# EasyEDA Pro project PCB_Claysight_MK2.epro

# Board PCB_Claysight-MK2
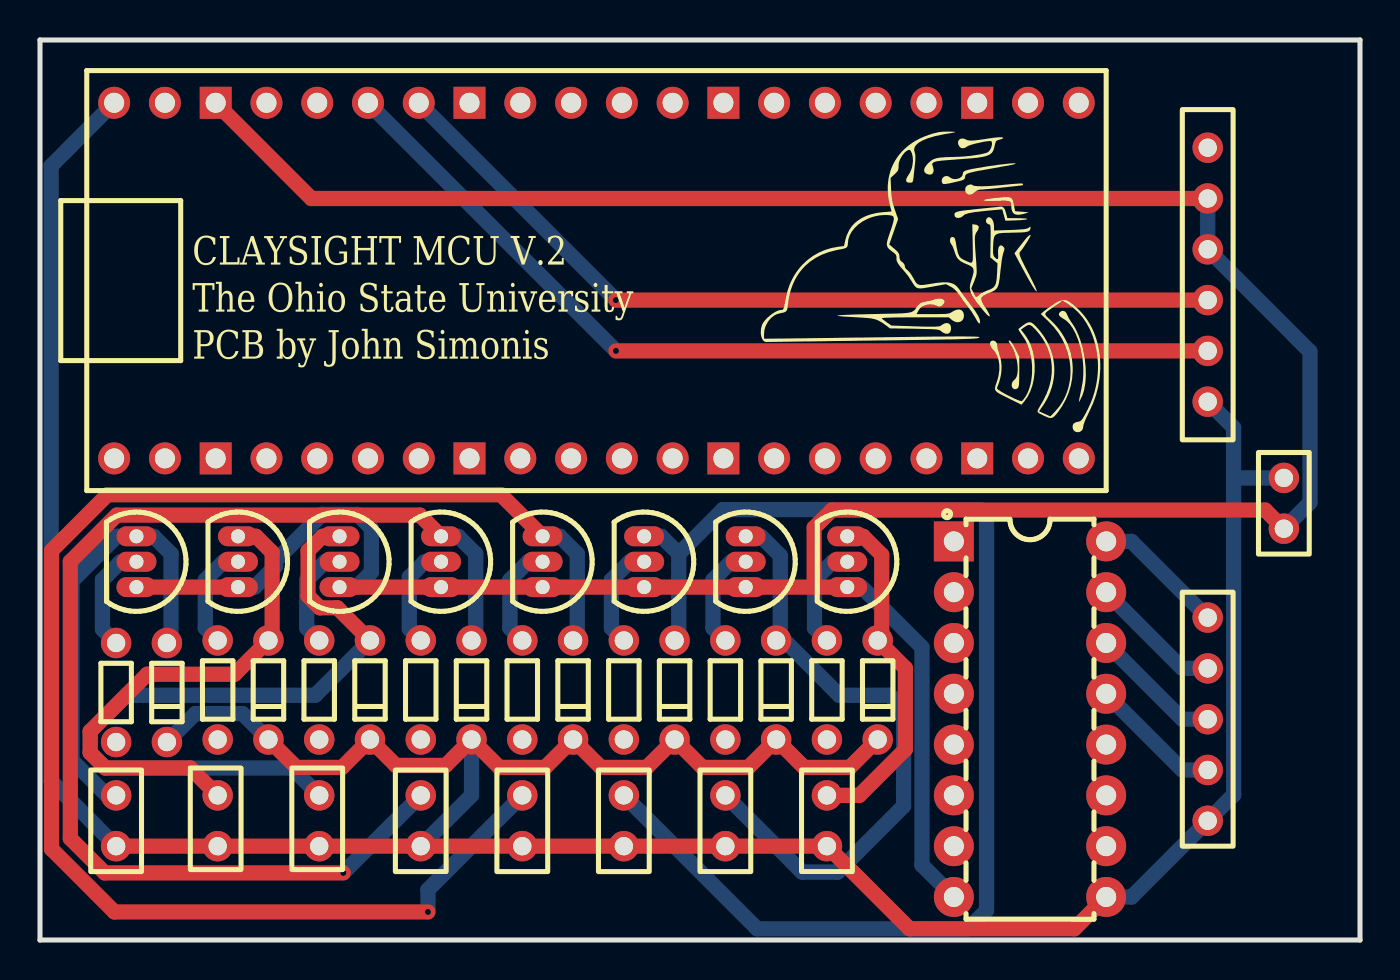
[diagram p0: board, top side]
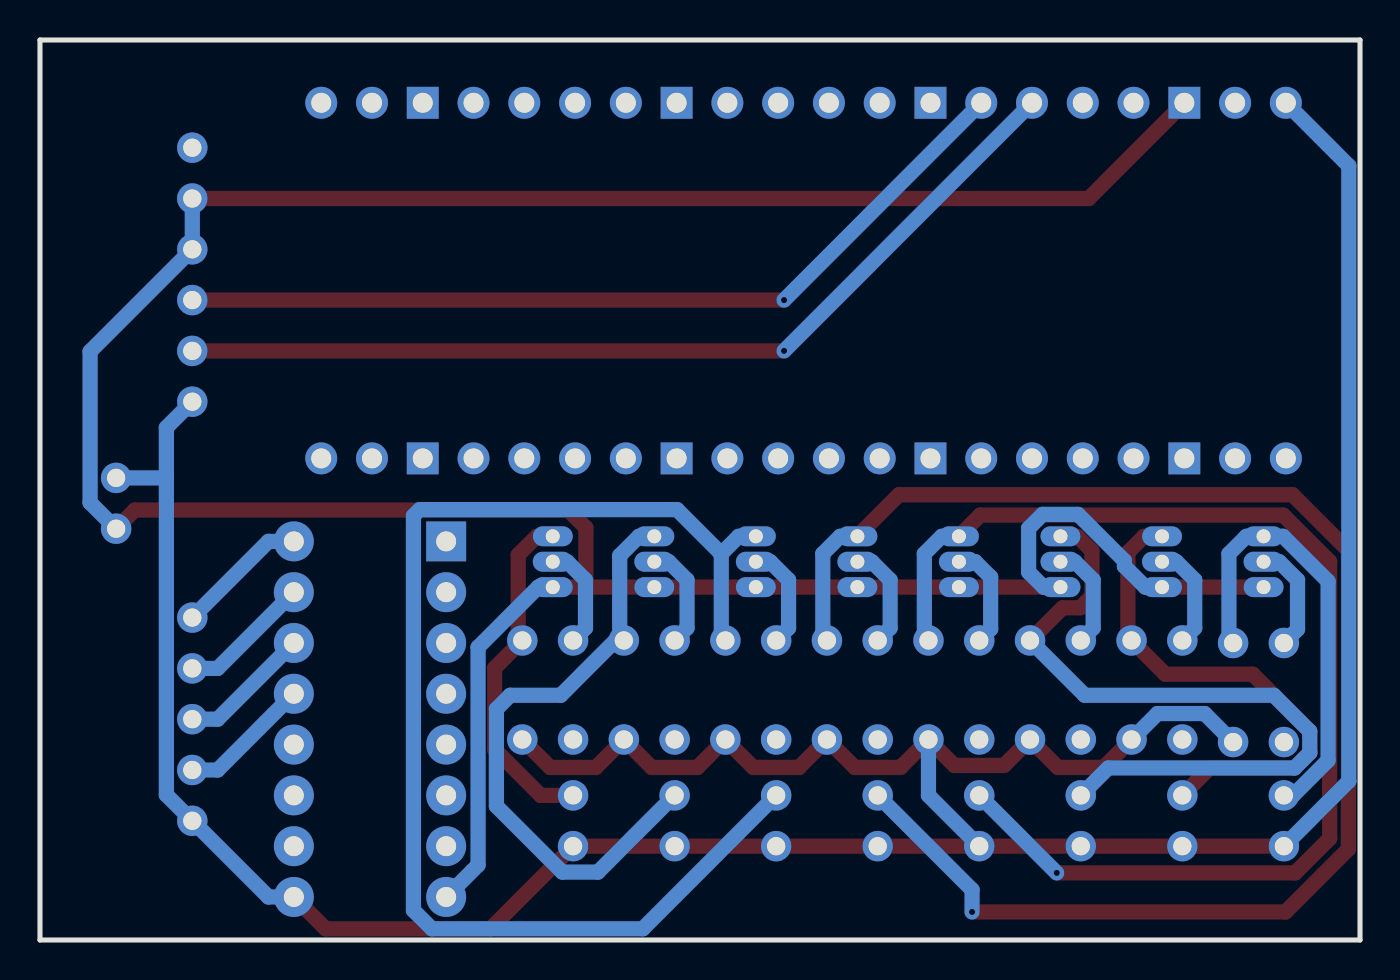
[diagram p1: board, bottom side, seen from below]

Outline 66.04 x 45 mm; copper layers: Top Layer, Bottom Layer. Coordinates in mm from the lower left corner of the outline.
Outline path: 0,45 66.04,45 66.04,0 0,0 0,45

## Design rules (mm)
spacing Default (default): track to track 0.152, other pairs 0 to 0.152
track width Default (default): min 0.762, default 0.762, max 25.4
via Default (default): diameter min 0.61, default 0.61, max 100.025; hole min 0.305, default 0.305, max 59.995

## Placement (name value [footprint] x y rotation side)
NOREF  -  [Pad_e420]  24.13 7.23 0 top
NOREF#2  -  [Pad_e401]  58.42 32 90 top
NOREF#3  -  [Pad_e400]  58.42 29.46 90 top
NOREF#4  -  [Pad_e389]  26.67 14.98 270 top
NOREF#5  -  [Pad_e397]  6.35 9.9 270 top
NOREF#6  -  [Pad_e395]  11.43 14.98 270 top
NOREF#7  -  [Pad_e399]  58.42 26.92 90 top
NOREF#8  -  [Pad_e372]  13.97 14.98 270 top
NOREF#9  -  [Pad_e404]  58.42 39.62 90 top
NOREF#10  -  [Pad_e405]  58.42 5.96 90 top
NOREF#11  -  [Pad_e419]  19.05 4.69 0 top
NOREF#12  -  [Pad_e381]  39.37 10.02 270 top
NOREF#13  -  [Pad_e373]  19.05 10.02 270 top
NOREF#14  -  [Pad_e403]  58.42 37.08 90 top
NOREF#15  -  [Pad_e423]  29.21 4.69 0 top
NOREF#16  -  [Pad_e424]  34.29 7.23 0 top
NOREF#17  -  [Pad_e380]  34.29 14.98 270 top
NOREF#18  -  [Pad_e384]  41.91 10.02 270 top
NOREF#19  -  [Pad_e413]  3.81 7.23 0 top
NOREF#20  -  [Pad_e412]  3.81 4.69 0 top
NOREF#21  -  [Pad_e378]  29.21 14.98 270 top
NOREF#22  -  [Pad_e408]  58.42 13.58 90 top
NOREF#23  -  [Pad_e387]  31.75 14.98 270 top
NOREF#24  -  [Pad_e371]  13.97 10.02 270 top
NOREF#25  -  [Pad_e414]  8.89 4.69 0 top
NOREF#26  -  [Pad_e393]  16.51 14.98 270 top
NOREF#27  -  [Pad_e379]  34.29 10.02 270 top
NOREF#28  -  [Pad_e416]  13.97 7.23 0 top
NOREF#29  -  [Pad_e402]  58.42 34.54 90 top
NOREF#30  -  [Pad_e406]  58.42 8.5 90 top
NOREF#31  -  [Pad_e369]  8.89 10.02 270 top
NOREF#32  -  [Pad_e409]  58.42 16.12 90 top
NOREF#33  -  [Pad_e398]  6.35 14.85 270 top
NOREF#34  -  [Pad_e374]  19.05 14.98 270 top
NOREF#35  -  [Pad_e421]  24.13 4.69 0 top
NOREF#36  -  [Pad_e394]  16.51 10.02 270 top
NOREF#37  -  [Pad_e392]  21.59 10.02 270 top
NOREF#38  -  [Pad_e382]  39.37 14.98 270 top
NOREF#39  -  [Pad_e377]  29.21 10.02 270 top
NOREF#40  -  [Pad_e385]  36.83 14.98 270 top
NOREF#41  -  [Pad_e426]  39.37 7.23 0 top
NOREF#42  -  [Pad_e368]  3.81 9.9 270 top
NOREF#43  -  [Pad_e391]  21.59 14.98 270 top
NOREF#44  -  [Pad_e427]  39.37 4.69 0 top
NOREF#45  -  [Pad_e422]  29.21 7.23 0 top
NOREF#46  -  [Pad_e417]  13.97 4.69 0 top
NOREF#47  -  [Pad_e388]  31.75 10.02 270 top
NOREF#48  -  [Pad_e390]  26.67 10.02 270 top
NOREF#49  -  [Pad_e383]  41.91 14.98 270 top
NOREF#50  -  [Pad_e370]  8.89 14.98 270 top
NOREF#51  -  [Pad_e418]  19.05 7.23 0 top
NOREF#52  -  [Pad_e376]  24.13 14.98 270 top
NOREF#53  -  [Pad_e407]  58.42 11.04 90 top
NOREF#54  -  [Pad_e425]  34.29 4.69 0 top
NOREF#55  -  [Pad_e367]  3.81 14.85 270 top
NOREF#56  -  [Pad_e386]  36.83 10.02 270 top
NOREF#57  -  [Pad_e415]  8.89 7.23 0 top
NOREF#58  -  [Pad_e396]  11.43 10.02 270 top
NOREF#59  -  [Pad_e375]  24.13 10.02 270 top
NOREF#60  -  [Pad_e411]  62.23 23.11 0 top
NOREF#61  -  [Pad_e410]  62.23 20.57 0 top
SU1  -  [TO-92(TO-92-3)]  5.08 19.93 0 top
SU2  -  [TO-92(TO-92-3)]  10.16 19.93 0 top
SU3  -  [TO-92(TO-92-3)]  20.32 19.93 0 top
SU4  -  [TO-92(TO-92-3)]  15.24 19.93 0 top
SU5  -  [TO-92(TO-92-3)]  25.4 19.93 0 top
SU6  -  [TO-92(TO-92-3)]  30.48 19.93 0 top
SU7  -  [TO-92(TO-92-3)]  35.56 19.93 0 top
SU8  -  [TO-92(TO-92-3)]  40.64 19.93 0 top
U1  -  [RASPBERRY PI PICO/ RASPBERRY PI PICO W]  53.34 22.47 90 top
U2  -  [ULN2003A]  45.72 19.93 270 top

## Footprints (pads in the part's own frame, mm; a bottom-side part is the same pattern mirrored in y, then rotated)
Pad_e367
  round 1.524 hole 0.914: 2(0,0)
Pad_e368
  round 1.524 hole 0.914: 3(0,0)
Pad_e369
  round 1.524 hole 0.914: 3(0,0)
Pad_e370
  round 1.524 hole 0.914: 2(0,0)
Pad_e371
  round 1.524 hole 0.914: 3(0,0)
Pad_e372
  round 1.524 hole 0.914: 2(0,0)
Pad_e373
  round 1.524 hole 0.914: 3(0,0)
Pad_e374
  round 1.524 hole 0.914: 2(0,0)
Pad_e375
  round 1.524 hole 0.914: 3(0,0)
Pad_e376
  round 1.524 hole 0.914: 2(0,0)
Pad_e377
  round 1.524 hole 0.914: 3(0,0)
Pad_e378
  round 1.524 hole 0.914: 2(0,0)
Pad_e379
  round 1.524 hole 0.914: 3(0,0)
Pad_e380
  round 1.524 hole 0.914: 2(0,0)
Pad_e381
  round 1.524 hole 0.914: 3(0,0)
Pad_e382
  round 1.524 hole 0.914: 2(0,0)
Pad_e383
  round 1.524 hole 0.914: 2(0,0)
Pad_e384
  round 1.524 hole 0.914: 3(0,0)
Pad_e385
  round 1.524 hole 0.914: 2(0,0)
Pad_e386
  round 1.524 hole 0.914: 3(0,0)
Pad_e387
  round 1.524 hole 0.914: 2(0,0)
Pad_e388
  round 1.524 hole 0.914: 3(0,0)
Pad_e389
  round 1.524 hole 0.914: 2(0,0)
Pad_e390
  round 1.524 hole 0.914: 3(0,0)
Pad_e391
  round 1.524 hole 0.914: 2(0,0)
Pad_e392
  round 1.524 hole 0.914: 3(0,0)
Pad_e393
  round 1.524 hole 0.914: 2(0,0)
Pad_e394
  round 1.524 hole 0.914: 3(0,0)
Pad_e395
  round 1.524 hole 0.914: 2(0,0)
Pad_e396
  round 1.524 hole 0.914: 3(0,0)
Pad_e397
  round 1.524 hole 0.914: 3(0,0)
Pad_e398
  round 1.524 hole 0.914: 2(0,0)
Pad_e399
  round 1.524 hole 0.914: 4(0,0)
Pad_e400
  round 1.524 hole 0.914: 5(0,0)
Pad_e401
  round 1.524 hole 0.914: 6(0,0)
Pad_e402
  round 1.524 hole 0.914: 7(0,0)
Pad_e403
  round 1.524 hole 0.914: 8(0,0)
Pad_e404
  round 1.524 hole 0.914: 9(0,0)
Pad_e405
  round 1.524 hole 0.914: 11(0,0)
Pad_e406
  round 1.524 hole 0.914: 12(0,0)
Pad_e407
  round 1.524 hole 0.914: 13(0,0)
Pad_e408
  round 1.524 hole 0.914: 14(0,0)
Pad_e409
  round 1.524 hole 0.914: 15(0,0)
Pad_e410
  round 1.524 hole 0.914: 17(0,0)
Pad_e411
  round 1.524 hole 0.914: 18(0,0)
Pad_e412
  round 1.524 hole 0.914: 19(0,0)
Pad_e413
  round 1.524 hole 0.914: 20(0,0)
Pad_e414
  round 1.524 hole 0.914: 21(0,0)
Pad_e415
  round 1.524 hole 0.914: 23(0,0)
Pad_e416
  round 1.524 hole 0.914: 24(0,0)
Pad_e417
  round 1.524 hole 0.914: 25(0,0)
Pad_e418
  round 1.524 hole 0.914: 26(0,0)
Pad_e419
  round 1.524 hole 0.914: 27(0,0)
Pad_e420
  round 1.524 hole 0.914: 28(0,0)
Pad_e421
  round 1.524 hole 0.914: 29(0,0)
Pad_e422
  round 1.524 hole 0.914: 30(0,0)
Pad_e423
  round 1.524 hole 0.914: 31(0,0)
Pad_e424
  round 1.524 hole 0.914: 32(0,0)
Pad_e425
  round 1.524 hole 0.914: 33(0,0)
Pad_e426
  round 1.524 hole 0.914: 34(0,0)
Pad_e427
  round 1.524 hole 0.914: 35(0,0)
RASPBERRY PI PICO/ RASPBERRY PI PICO W
  round 1.6 hole 1: 1(1.61,49.63) 2(1.61,47.09) 4(1.61,42.01) 5(1.61,39.469) 6(1.61,36.929) 7(1.61,34.389) 9(1.61,29.309) 10(1.61,26.77) 11(1.61,24.23) 12(1.61,21.689) 14(1.61,16.61) 15(1.61,14.07) 16(1.61,11.53) 17(1.61,8.99) 19(1.61,3.91) 20(1.61,1.37) 21(19.39,1.37) 22(19.39,3.91) 24(19.39,8.99) 25(19.39,11.53) 26(19.39,14.07) 27(19.39,16.61) 29(19.39,21.689) 30(19.39,24.23) 31(19.39,26.77) 32(19.39,29.309) 34(19.39,34.389) 35(19.39,36.929) 36(19.39,39.469) 37(19.39,42.01) 39(19.39,47.09) 40(19.39,49.63)
  rect 1.6x1.6 hole 1: 3(1.61,44.55) 8(1.61,31.85) 13(1.61,19.15) 18(1.61,6.45) 23(19.39,6.45) 28(19.39,19.15) 33(19.39,31.85) 38(19.39,44.55)
TO-92(TO-92-3)
  oval 2x1 hole 0.7: 1(-0.254,0.254) 2(-0.254,-1.016) 3(-0.254,-2.286)
ULN2003A
  rect 2x2 hole 1: 1(0,0)
  round 2 hole 1: 2(2.54,0) 3(5.08,0) 4(7.62,0) 5(10.16,0) 6(12.7,0) 7(15.24,0) 8(17.78,0) 9(17.78,7.62) 10(15.24,7.62) 11(12.7,7.62) 12(10.16,7.62) 13(7.62,7.62) 14(5.08,7.62) 15(2.54,7.62) 16(0,7.62)

## Nets
N$12975: NOREF#14.8 NOREF#29.7 NOREF#61.17 SU1.3 SU2.3 SU3.3 SU4.3 SU5.3 SU6.3 SU7.3 SU8.3 U1.38 U2.8
N$12982: NOREF#5.3 NOREF#7.4 NOREF#10.11 NOREF#11.27 NOREF#15.31 NOREF#18.3 NOREF#20.19 NOREF#25.21 NOREF#35.29 NOREF#36.3 NOREF#37.3 NOREF#44.35 NOREF#46.25 NOREF#47.3 NOREF#48.3 NOREF#54.33 NOREF#56.3 NOREF#58.3 NOREF#60.18 U1.40 U2.9
N$13085: NOREF#55.2 SU1.2
N$13092: NOREF#50.2 SU2.2
N$13099: NOREF#8.2 SU4.2
N$13106: NOREF#34.2 SU3.2
N$13113: NOREF#52.2 SU5.2
N$13120: NOREF#21.2 SU6.2
N$13127: NOREF#17.2 SU7.2
N$13134: NOREF#38.2 SU8.2
N$13189: NOREF#19.20 NOREF#33.2 SU1.1
N$13196: NOREF#6.2 NOREF#57.23 SU2.1
N$13203: NOREF#26.2 NOREF#28.24 SU4.1
N$13210: NOREF#43.2 NOREF#51.26 SU3.1
N$13217: NOREF.28 NOREF#4.2 SU5.1
N$13224: NOREF#23.2 NOREF#45.30 SU6.1
N$13231: NOREF#16.32 NOREF#40.2 SU7.1
N$13238: NOREF#41.34 NOREF#49.2 SU8.1
N$13245: NOREF#32.15 U2.16
N$13252: NOREF#22.14 U2.15
N$13259: NOREF#53.13 U2.14
N$13266: NOREF#30.12 U2.13
N$13501: NOREF#3.5 U1.35
N$13508: NOREF#2.6 U1.34

Pads without a net: NOREF#9 9; NOREF#12 3; NOREF#13 3; NOREF#24 3; NOREF#27 3; NOREF#31 3; NOREF#39 3; NOREF#42 3; NOREF#59 3; U1 1 2 3 4 5 6 7 8 9 10 11 12 13 14 15 16 17 18 19 20 21 22 23 24 25 26 27 28 29 30 31 32 33 36 37 39; U2 1 2 3 4 5 6 7 10 11 12

## Via types
v1: diameter 0.61, hole 0.305, Top Layer to Bottom Layer, 4 vias

## Routing (per net, layer and track width the routed paths; a pad name or vN(x,y) marks a point on that pad's centre or on a via; arc(x,y) is an arc through that point)
N$12975: length 159.3
  Top Layer w0.762: 38.73,17.64 SU7.3 SU6.3 SU5.3 SU3.3 SU4.3 ; 38.73,17.64 38.73,20.61 39.61,21.5 61.3,21.5 NOREF#61.17 ; 38.73,17.64 SU8.3 ; NOREF#14.8 13.57,37.08 U1.38 ; SU2.3 SU1.3
  Bottom Layer w0.762: NOREF#61.17 63.53,21.87 63.53,29.42 NOREF#29.7 NOREF#14.8 ; SU4.3 15.83,17.64 16.58,18.4 16.58,20.59 15.88,21.28 14.11,21.28 11.79,18.96 11.79,18.69 10.74,17.64 SU2.3 ; U2.8 44.12,3.75 44.12,14.64 41.11,17.64 SU8.3
N$12982: length 172.9
  Top Layer w0.762: NOREF#20.19 NOREF#25.21 NOREF#46.25 NOREF#11.27 NOREF#35.29 NOREF#15.31 NOREF#54.33 NOREF#44.35 43.5,0.56 51.75,0.56 U2.9 ; NOREF#18.3 40.51,8.63 38.23,8.63 NOREF#56.3 35.43,8.63 33.15,8.63 NOREF#47.3 30.35,8.63 28.07,8.63 NOREF#48.3 25.27,8.63 22.99,8.63 NOREF#37.3 20.29,8.73 17.81,8.73 NOREF#36.3 15.11,8.63 12.83,8.63 NOREF#58.3
  Bottom Layer w0.762: 59.72,23.11 59.72,7.26 NOREF#10.11 54.61,2.15 U2.9 ; 59.72,23.11 59.72,25.62 NOREF#7.4 ; 59.72,23.11 NOREF#60.18 ; NOREF#11.27 21.59,7.23 NOREF#37.3 ; NOREF#5.3 7.77,11.32 10.13,11.32 NOREF#58.3 ; NOREF#20.19 0.56,7.94 0.56,38.71 U1.40
N$13085: length 5.5
  Bottom Layer w0.762: SU1.2 4.04,18.91 3.13,18 3.13,15.54 NOREF#55.2
N$13092: length 5.3
  Bottom Layer w0.762: SU2.2 9.18,18.91 8.27,18 8.27,15.6 NOREF#50.2
N$13099: length 5.3
  Bottom Layer w0.762: SU4.2 14.26,18.91 13.35,18 13.35,15.6 NOREF#8.2
N$13106: length 5.3
  Bottom Layer w0.762: SU3.2 19.25,18.91 18.48,18.14 18.48,15.55 NOREF#34.2
N$13113: length 5.3
  Bottom Layer w0.762: NOREF#52.2 23.51,15.6 23.51,18 24.42,18.91 SU5.2
N$13120: length 5.3
  Bottom Layer w0.762: SU6.2 29.5,18.91 28.59,18 28.59,15.6 NOREF#21.2
N$13127: length 5.3
  Bottom Layer w0.762: SU7.2 34.58,18.91 33.67,18 33.67,15.6 NOREF#17.2
N$13134: length 5.3
  Bottom Layer w0.762: NOREF#38.2 38.75,15.6 38.75,18 39.66,18.91 SU8.2
N$13189: length 22.7
  Bottom Layer w0.762: NOREF#19.20 3.35,7.23 1.6,8.98 1.6,17.94 3.85,20.18 SU1.1 5.68,20.18 6.56,19.31 6.56,15.06 NOREF#33.2
N$13196: length 25.6
  Top Layer w0.762: SU2.1 10.81,20.18 11.61,19.38 11.61,15.16 NOREF#6.2 9.74,13.29 5.37,13.29 2.51,10.43 2.51,9.36 3.27,8.6 7.52,8.6 NOREF#57.23
N$13203: length 37.4
  Top Layer w0.762: NOREF#26.2 14.88,16.61 14,16.61 13.41,17.2 13.41,19.46 14.14,20.18 SU4.1
  Bottom Layer w0.762: NOREF#28.24 12.6,8.6 3.27,8.6 2.51,9.36 2.51,10.43 4.32,12.24 13.77,12.24 NOREF#26.2
N$13210: length 60.2
  Top Layer w0.762: v1(15.17,3.35) 3.24,3.35 1.52,5.08 1.52,18.92 3.84,21.25 19,21.25 SU3.1
  Bottom Layer w0.762: SU3.1 20.92,20.18 21.8,19.31 21.8,15.19 NOREF#43.2 ; NOREF#51.26 v1(15.17,3.35)
N$13217: length 75.9
  Top Layer w0.762: SU5.1 23.06,22.27 3.38,22.27 0.58,19.47 0.58,4.55 3.72,1.4 v1(19.41,1.4)
  Bottom Layer w0.762: NOREF.28 19.41,2.51 v1(19.41,1.4) ; NOREF#4.2 26.88,15.19 26.88,19.31 26,20.18 SU5.1
N$13224: length 64
  Bottom Layer w0.762: NOREF#23.2 31.96,15.19 31.96,19.31 ; 31.96,19.31 31.08,20.18 SU6.1 ; 31.96,19.31 34.16,21.52 47.05,21.52 47.36,21.21 47.36,1.48 46.43,0.56 35.88,0.56 NOREF#45.30
N$13231: length 30.9
  Bottom Layer w0.762: NOREF#16.32 38.13,3.39 39.91,3.39 43.21,6.69 43.21,11.54 42.51,12.24 39.99,12.24 37.04,15.19 ; 37.04,15.19 37.04,19.22 36.07,20.18 SU7.1 ; 37.04,15.19 NOREF#40.2
N$13238: length 17.4
  Top Layer w0.762: SU8.1 41.18,20.18 42.11,19.25 42.11,15.18 NOREF#49.2 43.29,13.6 43.29,9.53 40.99,7.23 NOREF#41.34
N$13245: length 6.7
  Bottom Layer w0.762: U2.16 54.61,19.93 NOREF#32.15
N$13252: length 6.7
  Bottom Layer w0.762: NOREF#22.14 57.15,13.58 U2.15
N$13259: length 6.7
  Bottom Layer w0.762: U2.14 57.15,11.04 NOREF#53.13
N$13266: length 6.7
  Bottom Layer w0.762: NOREF#30.12 57.15,8.5 U2.13
N$13501: length 47.1
  Top Layer w0.762: NOREF#3.5 v1(28.81,29.46)
  Bottom Layer w0.762: U1.35 v1(28.81,29.46)
N$13508: length 43.6
  Top Layer w0.762: NOREF#2.6 v1(28.81,32)
  Bottom Layer w0.762: U1.34 v1(28.81,32)

## Text on the board
Top Silkscreen Layer: CLAYSIGHT MCU V.2 / The Ohio State University / PCB by John Simonis
